# Altium schematic sheet Sheet4.SchDoc: Memory ICs
size B; DocumentNumber: 4; SheetNumber: 4; SheetTotal: 5
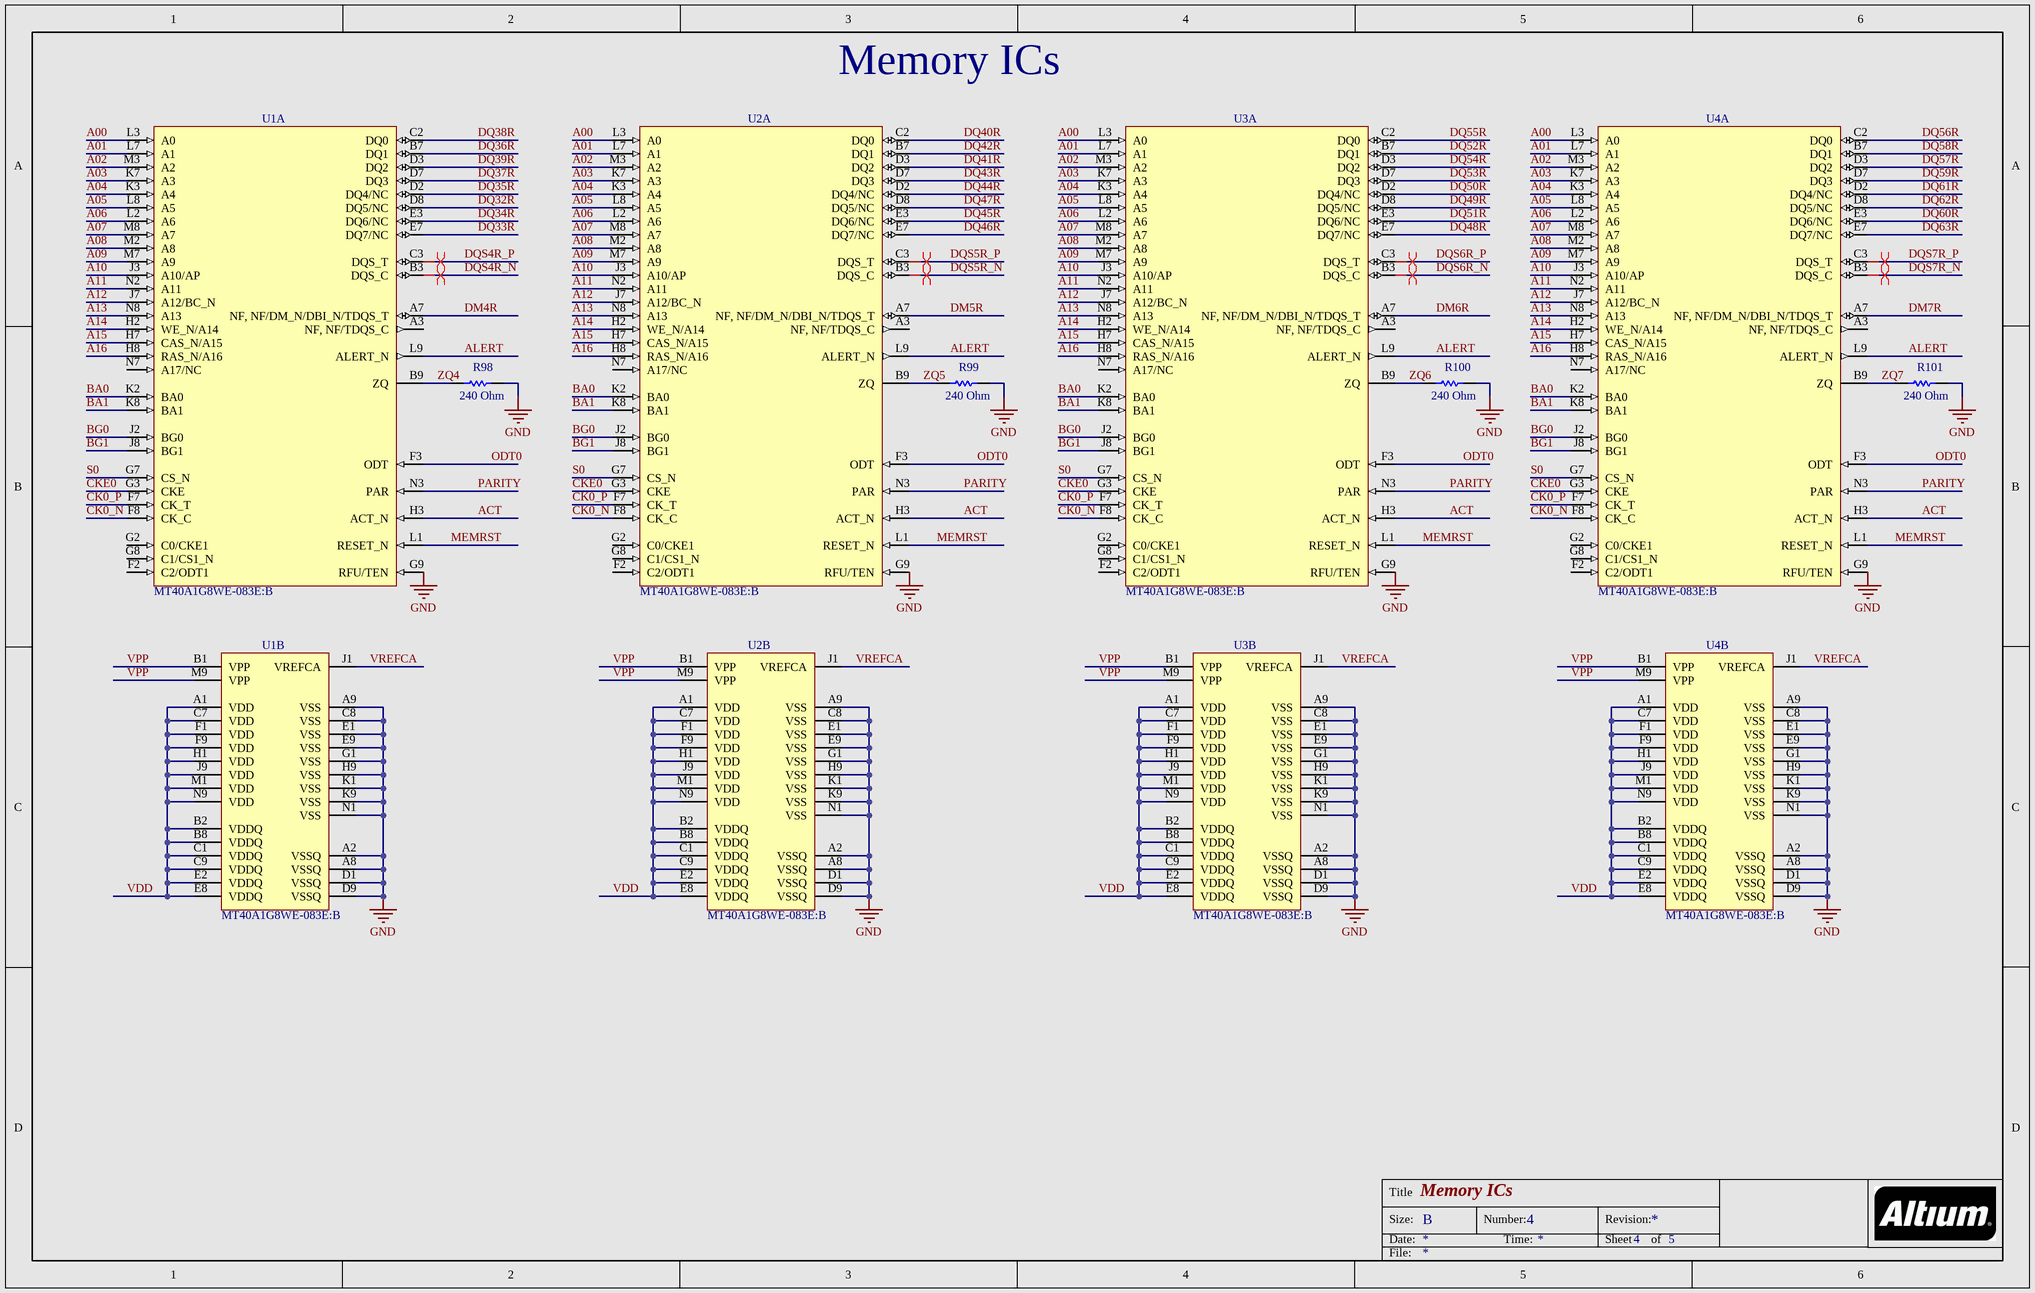
[diagram p0: Sheet4.SchDoc]

## Parts
R98  Resistance: 240 Ohm  [RESC1005X40X25ML05T05]  (hidden comment: ERJ-2GEJ241x)
R99  Resistance: 240 Ohm  [RESC1005X40X25ML05T05]  (hidden comment: ERJ-2GEJ241x)
R100  Resistance: 240 Ohm  [RESC1005X40X25ML05T05]  (hidden comment: ERJ-2GEJ241x)
R101  Resistance: 240 Ohm  [RESC1005X40X25ML05T05]  (hidden comment: ERJ-2GEJ241x)
U1  MT40A1G8WE-083E:B  [MICT-WE-78]  (parts A,B of 2)
U2  MT40A1G8WE-083E:B  [MICT-WE-78]  (parts A,B of 2)
U3  MT40A1G8WE-083E:B  [MICT-WE-78]  (parts A,B of 2)
U4  MT40A1G8WE-083E:B  [MICT-WE-78]  (parts A,B of 2)

## Nets
GND: R98.1 R99.1 R100.1 R101.1 U1.A2(VSSQ) U1.A8(VSSQ) U1.A9(VSS) U1.C8(VSS) U1.D1(VSSQ) U1.D9(VSSQ) U1.E1(VSS) U1.E9(VSS) U1.G1(VSS) U1.G9(RFU/TEN) U1.H9(VSS) U1.K1(VSS) U1.K9(VSS) U1.N1(VSS) U2.A2(VSSQ) U2.A8(VSSQ) U2.A9(VSS) U2.C8(VSS) U2.D1(VSSQ) U2.D9(VSSQ) U2.E1(VSS) U2.E9(VSS) U2.G1(VSS) U2.G9(RFU/TEN) U2.H9(VSS) U2.K1(VSS) U2.K9(VSS) U2.N1(VSS) U3.A2(VSSQ) U3.A8(VSSQ) U3.A9(VSS) U3.C8(VSS) U3.D1(VSSQ) U3.D9(VSSQ) U3.E1(VSS) U3.E9(VSS) U3.G1(VSS) U3.G9(RFU/TEN) U3.H9(VSS) U3.K1(VSS) U3.K9(VSS) U3.N1(VSS) U4.A2(VSSQ) U4.A8(VSSQ) U4.A9(VSS) U4.C8(VSS) U4.D1(VSSQ) U4.D9(VSSQ) U4.E1(VSS) U4.E9(VSS) U4.G1(VSS) U4.G9(RFU/TEN) U4.H9(VSS) U4.K1(VSS) U4.K9(VSS) U4.N1(VSS)
A00: U1.L3(A0) U2.L3(A0) U3.L3(A0) U4.L3(A0)
A01: U1.L7(A1) U2.L7(A1) U3.L7(A1) U4.L7(A1)
A02: U1.M3(A2) U2.M3(A2) U3.M3(A2) U4.M3(A2)
A03: U1.K7(A3) U2.K7(A3) U3.K7(A3) U4.K7(A3)
A04: U1.K3(A4) U2.K3(A4) U3.K3(A4) U4.K3(A4)
A05: U1.L8(A5) U2.L8(A5) U3.L8(A5) U4.L8(A5)
A06: U1.L2(A6) U2.L2(A6) U3.L2(A6) U4.L2(A6)
A07: U1.M8(A7) U2.M8(A7) U3.M8(A7) U4.M8(A7)
A08: U1.M2(A8) U2.M2(A8) U3.M2(A8) U4.M2(A8)
A09: U1.M7(A9) U2.M7(A9) U3.M7(A9) U4.M7(A9)
A10: U1.J3(A10/AP) U2.J3(A10/AP) U3.J3(A10/AP) U4.J3(A10/AP)
A11: U1.N2(A11) U2.N2(A11) U3.N2(A11) U4.N2(A11)
A12: U1.J7(A12/BC_N) U2.J7(A12/BC_N) U3.J7(A12/BC_N) U4.J7(A12/BC_N)
A13: U1.N8(A13) U2.N8(A13) U3.N8(A13) U4.N8(A13)
A14: U1.H2(WE_N/A14) U2.H2(WE_N/A14) U3.H2(WE_N/A14) U4.H2(WE_N/A14)
A15: U1.H7(CAS_N/A15) U2.H7(CAS_N/A15) U3.H7(CAS_N/A15) U4.H7(CAS_N/A15)
A16: U1.H8(RAS_N/A16) U2.H8(RAS_N/A16) U3.H8(RAS_N/A16) U4.H8(RAS_N/A16)
ACT: U1.H3(ACT_N) U2.H3(ACT_N) U3.H3(ACT_N) U4.H3(ACT_N)
ALERT: U1.L9(ALERT_N) U2.L9(ALERT_N) U3.L9(ALERT_N) U4.L9(ALERT_N)
BA0: U1.K2(BA0) U2.K2(BA0) U3.K2(BA0) U4.K2(BA0)
BA1: U1.K8(BA1) U2.K8(BA1) U3.K8(BA1) U4.K8(BA1)
BG0: U1.J2(BG0) U2.J2(BG0) U3.J2(BG0) U4.J2(BG0)
BG1: U1.J8(BG1) U2.J8(BG1) U3.J8(BG1) U4.J8(BG1)
CK0_N: U1.F8(CK_C) U2.F8(CK_C) U3.F8(CK_C) U4.F8(CK_C)
CK0_P: U1.F7(CK_T) U2.F7(CK_T) U3.F7(CK_T) U4.F7(CK_T)
CKE0: U1.G3(CKE) U2.G3(CKE) U3.G3(CKE) U4.G3(CKE)
DM4R: U1.A7(NF,_NF/DM_N/DBI_N/TDQS_T)
DM5R: U2.A7(NF,_NF/DM_N/DBI_N/TDQS_T)
DM6R: U3.A7(NF,_NF/DM_N/DBI_N/TDQS_T)
DM7R: U4.A7(NF,_NF/DM_N/DBI_N/TDQS_T)
DQ32R: U1.D8(DQ5/NC)
DQ33R: U1.E7(DQ7/NC)
DQ34R: U1.E3(DQ6/NC)
DQ35R: U1.D2(DQ4/NC)
DQ36R: U1.B7(DQ1)
DQ37R: U1.D7(DQ3)
DQ38R: U1.C2(DQ0)
DQ39R: U1.D3(DQ2)
DQ40R: U2.C2(DQ0)
DQ41R: U2.D3(DQ2)
DQ42R: U2.B7(DQ1)
DQ43R: U2.D7(DQ3)
DQ44R: U2.D2(DQ4/NC)
DQ45R: U2.E3(DQ6/NC)
DQ46R: U2.E7(DQ7/NC)
DQ47R: U2.D8(DQ5/NC)
DQ48R: U3.E7(DQ7/NC)
DQ49R: U3.D8(DQ5/NC)
DQ50R: U3.D2(DQ4/NC)
DQ51R: U3.E3(DQ6/NC)
DQ52R: U3.B7(DQ1)
DQ53R: U3.D7(DQ3)
DQ54R: U3.D3(DQ2)
DQ55R: U3.C2(DQ0)
DQ56R: U4.C2(DQ0)
DQ57R: U4.D3(DQ2)
DQ58R: U4.B7(DQ1)
DQ59R: U4.D7(DQ3)
DQ60R: U4.E3(DQ6/NC)
DQ61R: U4.D2(DQ4/NC)
DQ62R: U4.D8(DQ5/NC)
DQ63R: U4.E7(DQ7/NC)
DQS4R_N: U1.B3(DQS_C)
DQS4R_P: U1.C3(DQS_T)
DQS5R_N: U2.B3(DQS_C)
DQS5R_P: U2.C3(DQS_T)
DQS6R_N: U3.B3(DQS_C)
DQS6R_P: U3.C3(DQS_T)
DQS7R_N: U4.B3(DQS_C)
DQS7R_P: U4.C3(DQS_T)
MEMRST: U1.L1(RESET_N) U2.L1(RESET_N) U3.L1(RESET_N) U4.L1(RESET_N)
ODT0: U1.F3(ODT) U2.F3(ODT) U3.F3(ODT) U4.F3(ODT)
PARITY: U1.N3(PAR) U2.N3(PAR) U3.N3(PAR) U4.N3(PAR)
S0: U1.G7(CS_N) U2.G7(CS_N) U3.G7(CS_N) U4.G7(CS_N)
VDD: U1.A1(VDD) U1.B2(VDDQ) U1.B8(VDDQ) U1.C1(VDDQ) U1.C7(VDD) U1.C9(VDDQ) U1.E2(VDDQ) U1.E8(VDDQ) U1.F1(VDD) U1.F9(VDD) U1.H1(VDD) U1.J9(VDD) U1.M1(VDD) U1.N9(VDD) U2.A1(VDD) U2.B2(VDDQ) U2.B8(VDDQ) U2.C1(VDDQ) U2.C7(VDD) U2.C9(VDDQ) U2.E2(VDDQ) U2.E8(VDDQ) U2.F1(VDD) U2.F9(VDD) U2.H1(VDD) U2.J9(VDD) U2.M1(VDD) U2.N9(VDD) U3.A1(VDD) U3.B2(VDDQ) U3.B8(VDDQ) U3.C1(VDDQ) U3.C7(VDD) U3.C9(VDDQ) U3.E2(VDDQ) U3.E8(VDDQ) U3.F1(VDD) U3.F9(VDD) U3.H1(VDD) U3.J9(VDD) U3.M1(VDD) U3.N9(VDD) U4.A1(VDD) U4.B2(VDDQ) U4.B8(VDDQ) U4.C1(VDDQ) U4.C7(VDD) U4.C9(VDDQ) U4.E2(VDDQ) U4.E8(VDDQ) U4.F1(VDD) U4.F9(VDD) U4.H1(VDD) U4.J9(VDD) U4.M1(VDD) U4.N9(VDD)
VPP: U1.B1(VPP) U1.M9(VPP) U2.B1(VPP) U2.M9(VPP) U3.B1(VPP) U3.M9(VPP) U4.B1(VPP) U4.M9(VPP)
VREFCA: U1.J1(VREFCA) U2.J1(VREFCA) U3.J1(VREFCA) U4.J1(VREFCA)
ZQ4: R98.2 U1.B9(ZQ)
ZQ5: R99.2 U2.B9(ZQ)
ZQ6: R100.2 U3.B9(ZQ)
ZQ7: R101.2 U4.B9(ZQ)

Not connected (* = marked no-connect by the designer): U1 A3(NF,_NF/TDQS_C) F2(C2/ODT1) G2(C0/CKE1) G8(C1/CS1_N) N7(A17/NC); U2 A3(NF,_NF/TDQS_C) F2(C2/ODT1) G2(C0/CKE1) G8(C1/CS1_N) N7(A17/NC); U3 A3(NF,_NF/TDQS_C) F2(C2/ODT1) G2(C0/CKE1) G8(C1/CS1_N) N7(A17/NC); U4 A3(NF,_NF/TDQS_C) F2(C2/ODT1) G2(C0/CKE1) G8(C1/CS1_N) N7(A17/NC)

## Layout directives
differential pair: DQS4R_N, DQS4R_P, DQS5R_N, DQS5R_P, DQS6R_N, DQS6R_P, DQS7R_N, DQS7R_P

## Notes on the sheet
- Title
- Size:
- Date:
- B
- Number:
- Time:
- Revision:
- Sheet
- of
- File:

## Library data of the parts
R98-R101 = CMP-2002-00493-3: Chip Resistor, 240 Ohm, +/- 5%, 100 mW, -55 to 155 degC, 0402 (1005 Metric), RoHS, Tape and Reel; Manufacturer: Basic Passives; Voltage Rating: 50 V; Case\/Package: 0402; Power Rating: 100 mW; PackageReference: 0402; ComponentLink1URL: http://www.panasonic.com/; ComponentLink2Description: Datasheet; PackageDescription: 2-Pin Surface Mount Device, Body 1 x 0.5 mm; Tolerance: 5%; Radiation Hardening: No; Packaging: Tape and Reel; Case Code (Metric): 1005; PartNumber: ERJ-2GEJ241x; Case Code (Imperial): 0402; Mount: Surface Mount; REACH SVHC: Yes; Length: 1 mm; Mounting Technology: Surface Mount; Max Operating Temperature: 155 degC; Height: 0.35 mm; Width: 0.5 mm; Package Quantity: 10000; RoHSCompliant: true; DatasheetVersion: 03/2015; Pins: 2; ComponentLink1Description: Manufacturer URL; Min Operating Temperature: -55 degC; ComponentLink2URL: http://industrial.panasonic.com/cdbs/www-data/pdf/RDA0000/AOA0000C84.pdf
U1-U4 = CMP-1738-00001-1: 8 Gb DDR4 SDRAM, 1 Gig x 8, 1.2 V, 0 to 95 degC, 78-Ball FBGA (WE), RoHS; DatasheetVersion: Rev. E, 05/2016; ComponentLink2Description: Datasheet; ComponentLink2URL: https://www.micron.com/~/media/documents/products/data-sheet/dram/ddr4/8gb_ddr4_sdram.pdf; PartNumber: MT40A1G8WE-083E:B; PackageDescription: 78-Ball Ball Grid Array, Body 8 x 12 mm, Pitch 0.8 mm; ComponentLink1URL: http://www.micron.com/; ComponentLink1Description: Manufacturer URL; Mounting Technology: Surface Mount; PartId: 1